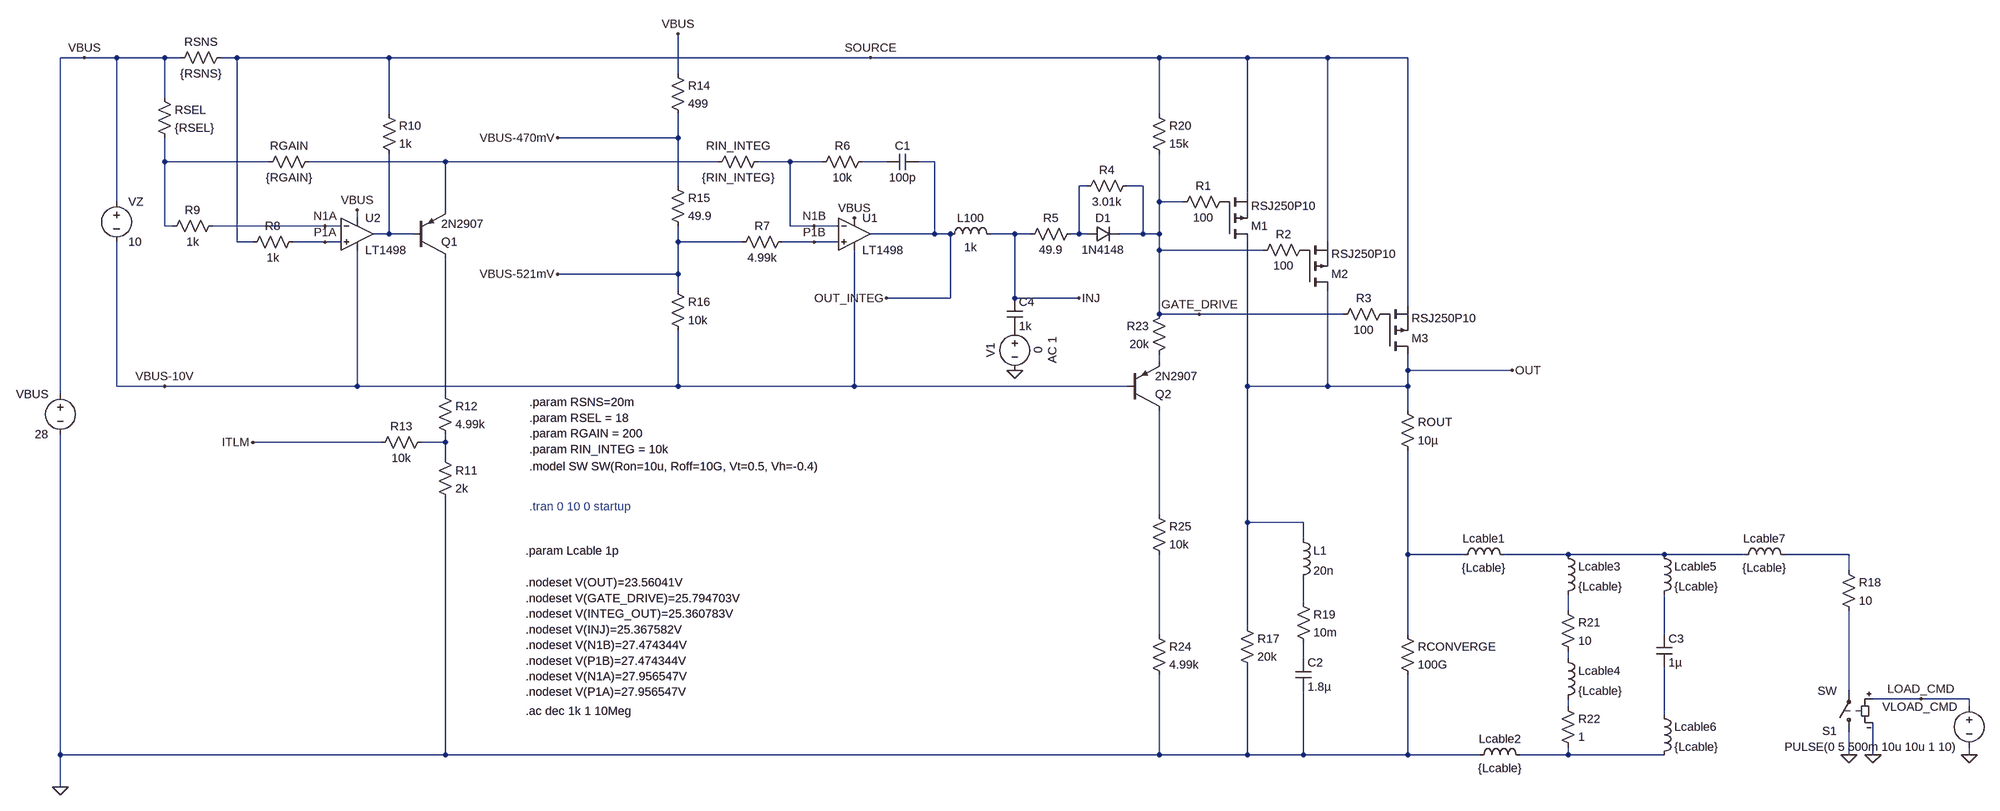
[diagram p0: schematic LM_RPC.asc]
LM_RPC.asc, the LTspice schematic file:
Version 4.1
SHEET 1 2276 1416
WIRE -1568 -208 -1616 -208
WIRE -1504 -208 -1568 -208
WIRE -1408 -208 -1504 -208
WIRE -1376 -208 -1408 -208
WIRE -1264 -208 -1296 -208
WIRE -960 -208 -1264 -208
WIRE 0 -208 -960 -208
WIRE 576 -208 0 -208
WIRE 752 -208 576 -208
WIRE 912 -208 752 -208
WIRE 1072 -208 912 -208
WIRE -384 -176 -384 -256
WIRE -1408 -128 -1408 -208
WIRE -960 -96 -960 -208
WIRE 576 -96 576 -208
WIRE -384 -48 -384 -96
WIRE -384 -48 -624 -48
WIRE -1408 0 -1408 -48
WIRE -1200 0 -1408 0
WIRE -848 0 -1120 0
WIRE -304 0 -848 0
WIRE -160 0 -224 0
WIRE -96 0 -160 0
WIRE 32 0 -16 0
WIRE 128 0 96 0
WIRE -384 48 -384 -48
WIRE 432 48 416 48
WIRE 544 48 512 48
WIRE 752 64 752 -208
WIRE -1504 80 -1504 -208
WIRE 576 80 576 -16
WIRE 624 80 576 80
WIRE -848 96 -848 0
WIRE -1024 112 -1024 96
WIRE -1408 128 -1408 0
WIRE -1392 128 -1408 128
WIRE -1088 128 -1312 128
WIRE -1056 128 -1088 128
WIRE -160 128 -160 0
WIRE -112 128 -160 128
WIRE -64 128 -112 128
WIRE -960 144 -960 -16
WIRE -960 144 -992 144
WIRE -912 144 -960 144
WIRE 128 144 128 0
WIRE 128 144 0 144
WIRE 160 144 128 144
WIRE 288 144 240 144
WIRE 320 144 288 144
WIRE 416 144 416 48
WIRE 416 144 400 144
WIRE 432 144 416 144
WIRE 544 144 544 48
WIRE 544 144 496 144
WIRE 576 144 576 80
WIRE 576 144 544 144
WIRE -1264 160 -1264 -208
WIRE -1232 160 -1264 160
WIRE -1088 160 -1152 160
WIRE -1056 160 -1088 160
WIRE -384 160 -384 128
WIRE -256 160 -384 160
WIRE -112 160 -176 160
WIRE -64 160 -112 160
WIRE 912 160 912 -208
WIRE 576 176 576 144
WIRE 784 176 576 176
WIRE -384 224 -384 160
WIRE -384 224 -624 224
WIRE -384 256 -384 224
WIRE 160 272 160 144
WIRE 160 272 32 272
WIRE 288 272 288 144
WIRE 416 272 288 272
WIRE 1072 288 1072 -208
WIRE 576 304 576 176
WIRE 656 304 576 304
WIRE 944 304 656 304
WIRE 576 400 576 384
WIRE 1072 416 1072 384
WIRE 1280 416 1072 416
WIRE -1504 448 -1504 160
WIRE -1408 448 -1504 448
WIRE -1024 448 -1024 176
WIRE -1024 448 -1408 448
WIRE -384 448 -384 336
WIRE -384 448 -1024 448
WIRE -32 448 -32 176
WIRE -32 448 -384 448
WIRE 512 448 -32 448
WIRE 752 448 752 160
WIRE 912 448 912 256
WIRE 912 448 752 448
WIRE 1072 448 1072 416
WIRE 1072 448 912 448
WIRE -1616 464 -1616 -208
WIRE -848 464 -848 192
WIRE 1072 496 1072 448
WIRE -976 560 -1232 560
WIRE -848 560 -848 544
WIRE -848 560 -896 560
WIRE -848 592 -848 560
WIRE 576 704 576 496
WIRE 752 720 752 448
WIRE 864 720 752 720
WIRE 864 752 864 720
WIRE 1072 784 1072 576
WIRE 1184 784 1072 784
WIRE 1392 784 1264 784
WIRE 1584 784 1392 784
WIRE 1744 784 1584 784
WIRE 1952 784 1824 784
WIRE 1952 816 1952 784
WIRE 864 880 864 832
WIRE 1392 896 1392 864
WIRE 752 928 752 720
WIRE 576 944 576 784
WIRE 1072 944 1072 784
WIRE 1584 944 1584 864
WIRE 864 992 864 960
WIRE 1392 992 1392 976
WIRE 1952 1056 1952 896
WIRE 2096 1072 2000 1072
WIRE 2192 1072 2096 1072
WIRE 1392 1088 1392 1072
WIRE 2192 1088 2192 1072
WIRE 1584 1104 1584 1008
WIRE -1616 1184 -1616 544
WIRE -848 1184 -848 672
WIRE -848 1184 -1616 1184
WIRE 576 1184 576 1024
WIRE 576 1184 -848 1184
WIRE 752 1184 752 1008
WIRE 752 1184 576 1184
WIRE 864 1184 864 1056
WIRE 864 1184 752 1184
WIRE 1072 1184 1072 1024
WIRE 1072 1184 864 1184
WIRE 1216 1184 1072 1184
WIRE 1392 1184 1392 1168
WIRE 1392 1184 1296 1184
WIRE 1584 1184 1392 1184
WIRE 1952 1184 1952 1136
WIRE 2000 1184 2000 1120
WIRE 2192 1184 2192 1168
WIRE -1616 1248 -1616 1184
FLAG 32 272 OUT_INTEG
FLAG 656 304 GATE_DRIVE
FLAG 416 272 INJ
FLAG -1568 -208 VBUS
FLAG -32 112 VBUS
FLAG -1024 96 VBUS
FLAG -1232 560 ITLM
FLAG -624 -48 VBUS-470mV
FLAG -624 224 VBUS-521mV
FLAG 1952 1184 0
FLAG 2192 1184 0
FLAG 2000 1184 0
FLAG 2096 1072 LOAD_CMD
FLAG -384 -256 VBUS
FLAG 1280 416 OUT
FLAG -1408 448 VBUS-10V
FLAG -1088 160 P1A
FLAG -1088 128 N1A
FLAG -112 160 P1B
FLAG -112 128 N1B
FLAG 0 -208 SOURCE
FLAG -1616 1248 0
FLAG 288 416 0
DATAFLAG 1184 416 ""
DATAFLAG 640 176 ""
DATAFLAG -768 -208 ""
DATAFLAG -768 -208 ""
DATAFLAG -1488 -208 ""
SYMBOL res 720 64 R90
WINDOW 0 0 56 VBottom 2
WINDOW 3 32 56 VTop 2
SYMATTR InstName R1
SYMATTR Value 100
SYMBOL res 880 160 R90
WINDOW 0 0 56 VBottom 2
WINDOW 3 32 56 VTop 2
SYMATTR InstName R2
SYMATTR Value 100
SYMBOL res 1040 288 R90
WINDOW 0 0 56 VBottom 2
WINDOW 3 32 56 VTop 2
SYMATTR InstName R3
SYMATTR Value 100
SYMBOL diode 432 160 R270
WINDOW 0 32 32 VTop 2
WINDOW 3 0 32 VBottom 2
SYMATTR InstName D1
SYMATTR Value 1N4148
SYMBOL res 528 32 R90
WINDOW 0 0 56 VBottom 2
WINDOW 3 32 56 VTop 2
SYMATTR InstName R4
SYMATTR Value 3.01k
SYMBOL res 416 128 R90
WINDOW 0 0 56 VBottom 2
WINDOW 3 32 56 VTop 2
SYMATTR InstName R5
SYMATTR Value 49.9
SYMBOL voltage 288 320 R0
WINDOW 0 -32 56 VBottom 2
WINDOW 3 32 56 VTop 2
WINDOW 123 60 56 VTop 2
WINDOW 39 0 0 Left 0
SYMATTR InstName V1
SYMATTR Value 0
SYMATTR Value2 AC 1
SYMBOL OpAmps\\LT1498 -32 80 R0
SYMATTR InstName U1
SYMBOL res -1392 -192 R270
WINDOW 0 32 56 VTop 2
WINDOW 3 0 56 VBottom 2
SYMATTR InstName RSNS
SYMATTR Value {RSNS}
SYMBOL voltage -1616 448 M0
SYMATTR InstName VBUS
SYMATTR Value 28
SYMBOL res -208 -16 R90
WINDOW 0 0 56 VBottom 2
WINDOW 3 32 56 VTop 2
SYMATTR InstName RIN_INTEG
SYMATTR Value {RIN_INTEG}
SYMBOL res 0 -16 R90
WINDOW 0 0 56 VBottom 2
WINDOW 3 32 56 VTop 2
SYMATTR InstName R6
SYMATTR Value 10k
SYMBOL cap 96 -16 R90
WINDOW 0 0 32 VBottom 2
WINDOW 3 32 32 VTop 2
SYMATTR InstName C1
SYMATTR Value 100p
SYMBOL voltage -1504 64 R0
WINDOW 123 0 0 Left 0
WINDOW 39 0 0 Left 0
SYMATTR InstName VZ
SYMATTR Value 10
SYMBOL res -160 144 R90
WINDOW 0 0 56 VBottom 2
WINDOW 3 32 56 VTop 2
SYMATTR InstName R7
SYMATTR Value 4.99k
SYMBOL res -1424 -144 R0
SYMATTR InstName RSEL
SYMATTR Value {RSEL}
SYMBOL res -1136 144 R90
WINDOW 0 0 56 VBottom 2
WINDOW 3 32 56 VTop 2
SYMATTR InstName R8
SYMATTR Value 1k
SYMBOL res -1296 112 R90
WINDOW 0 0 56 VBottom 2
WINDOW 3 32 56 VTop 2
SYMATTR InstName R9
SYMATTR Value 1k
SYMBOL OpAmps\\LT1498 -1024 80 R0
SYMATTR InstName U2
SYMBOL res -1104 -16 R90
WINDOW 0 0 56 VBottom 2
WINDOW 3 32 56 VTop 2
SYMATTR InstName RGAIN
SYMATTR Value {RGAIN}
SYMBOL pnp -912 192 M180
SYMATTR InstName Q1
SYMATTR Value 2N2907
SYMBOL res -976 -112 R0
SYMATTR InstName R10
SYMATTR Value 1k
SYMBOL res -864 576 R0
SYMATTR InstName R11
SYMATTR Value 2k
SYMBOL res -864 448 R0
SYMATTR InstName R12
SYMATTR Value 4.99k
SYMBOL res -880 544 R90
WINDOW 0 0 56 VBottom 2
WINDOW 3 32 56 VTop 2
SYMATTR InstName R13
SYMATTR Value 10k
SYMBOL res -400 -192 R0
SYMATTR InstName R14
SYMATTR Value 499
SYMBOL res -400 32 R0
SYMATTR InstName R15
SYMATTR Value 49.9
SYMBOL res -400 240 R0
SYMATTR InstName R16
SYMATTR Value 10k
SYMBOL res 736 912 R0
SYMATTR InstName R17
SYMATTR Value 20k
SYMBOL cap 848 992 R0
SYMATTR InstName C2
SYMATTR Value 1.8µ
SYMBOL sw 1952 1152 R180
SYMATTR InstName S1
SYMBOL voltage 2192 1072 M0
WINDOW 123 0 0 Left 0
WINDOW 39 0 0 Left 0
SYMATTR InstName VLOAD_CMD
SYMATTR Value PULSE(0 5 500m 10u 10u 1 10)
SYMBOL res 1056 480 R0
SYMATTR InstName ROUT
SYMATTR Value 10µ
SYMBOL res 560 -112 R0
SYMATTR InstName R20
SYMATTR Value 15k
SYMBOL pmos 704 160 M180
SYMATTR InstName M1
SYMATTR Value RSJ250P10
SYMBOL pmos 864 256 M180
SYMATTR InstName M2
SYMATTR Value RSJ250P10
SYMBOL pmos 1024 384 M180
SYMATTR InstName M3
SYMATTR Value RSJ250P10
SYMBOL res 1056 928 R0
SYMATTR InstName RCONVERGE
SYMATTR Value 100G
SYMBOL ind 1168 800 R270
WINDOW 0 32 56 VTop 2
WINDOW 3 5 56 VBottom 2
SYMATTR InstName Lcable1
SYMATTR Value {Lcable}
SYMBOL ind 1200 1200 R270
WINDOW 0 32 56 VTop 2
WINDOW 3 5 56 VBottom 2
SYMATTR InstName Lcable2
SYMATTR Value {Lcable}
SYMBOL ind 1376 768 R0
SYMATTR InstName Lcable3
SYMATTR Value {Lcable}
SYMBOL res 1376 880 R0
SYMATTR InstName R21
SYMATTR Value 10
SYMBOL ind 1376 976 R0
SYMATTR InstName Lcable4
SYMATTR Value {Lcable}
SYMBOL res 1376 1072 R0
SYMATTR InstName R22
SYMATTR Value 1
SYMBOL ind 1568 768 R0
SYMATTR InstName Lcable5
SYMATTR Value {Lcable}
SYMBOL ind 1568 1088 R0
SYMATTR InstName Lcable6
SYMATTR Value {Lcable}
SYMBOL cap 1568 944 R0
SYMATTR InstName C3
SYMATTR Value 1µ
SYMBOL ind 1728 800 R270
WINDOW 0 32 56 VTop 2
WINDOW 3 5 56 VBottom 2
SYMATTR InstName Lcable7
SYMATTR Value {Lcable}
SYMBOL res 1936 800 R0
SYMATTR InstName R18
SYMATTR Value 10
SYMBOL ind 848 736 R0
SYMATTR InstName L1
SYMATTR Value 20n
SYMBOL res 848 864 R0
SYMATTR InstName R19
SYMATTR Value 10m
SYMBOL pnp 512 496 M180
SYMATTR InstName Q2
SYMATTR Value 2N2907
SYMBOL res 592 288 M0
SYMATTR InstName R23
SYMATTR Value 20k
SYMBOL res 560 928 R0
SYMATTR InstName R24
SYMATTR Value 4.99k
SYMBOL res 560 688 R0
SYMATTR InstName R25
SYMATTR Value 10k
SYMBOL ind 144 160 R270
WINDOW 0 32 56 VTop 2
WINDOW 3 5 56 VBottom 2
SYMATTR InstName L100
SYMATTR Value 1k
SYMBOL cap 272 272 R0
SYMATTR InstName C4
SYMATTR Value 1k
TEXT -680 480 Left 2 !.param RSNS=20m\n.param RSEL = 18\n.param RGAIN = 200\n.param RIN_INTEG = 10k
TEXT -680 608 Left 2 !.model SW SW(Ron=10u, Roff=10G, Vt=0.5, Vh=-0.4)
TEXT -680 688 Left 2 ;.tran 0 10 0 startup
TEXT -688 776 Left 2 !.param Lcable 1p
TEXT -688 840 Left 2 !.nodeset V(OUT)=23.56041V\n.nodeset V(GATE_DRIVE)=25.794703V\n.nodeset V(INTEG_OUT)=25.360783V\n.nodeset V(INJ)=25.367582V\n.nodeset V(N1B)=27.474344V\n.nodeset V(P1B)=27.474344V\n.nodeset V(N1A)=27.956547V\n.nodeset V(P1A)=27.956547V
TEXT -688 1096 Left 2 !.ac dec 1k 1 10Meg

The netlist it stands for:
* LM_RPC.asc
R1 P001 GATE_DRIVE 100
R2 P002 GATE_DRIVE 100
R3 P003 GATE_DRIVE 100
D1 N004 GATE_DRIVE 1N4148
R4 GATE_DRIVE N004 3.01k
R5 N004 INJ 49.9
V1 P004 0 0 AC 1
X§U1 P1B N1B VBUS VBUS-10V OUT_INTEG LT1498  ; pins In+ In- V+ V- OUT
RSNS VBUS SOURCE {RSNS}
VBUS VBUS 0 28
RIN_INTEG N1B N002 {RIN_INTEG}
R6 N003 N1B 10k
C1 OUT_INTEG N003 100p
VZ VBUS VBUS-10V 10
R7 P1B VBUS-521mV 4.99k
RSEL VBUS N001 {RSEL}
R8 P1A SOURCE 1k
R9 N1A N001 1k
X§U2 P1A N1A VBUS VBUS-10V N005 LT1498  ; pins In+ In- V+ V- OUT
RGAIN N002 N001 {RGAIN}
Q1 N007 N005 N002 0 2N2907
R10 SOURCE N005 1k
R11 N008 0 2k
R12 N007 N008 4.99k
R13 N008 ITLM 10k
R14 VBUS VBUS-470mV 499
R15 VBUS-470mV VBUS-521mV 49.9
R16 VBUS-521mV VBUS-10V 10k
R17 OUT 0 20k
C2 N017 0 1.8µ
S1 0 N019 LOAD_CMD 0 SW
VLOAD_CMD LOAD_CMD 0 PULSE(0 5 500m 10u 10u 1 10)
ROUT OUT N010 10µ
R20 SOURCE GATE_DRIVE 15k
M1 OUT P001 SOURCE SOURCE RSJ250P10
M2 OUT P002 SOURCE SOURCE RSJ250P10
M3 OUT P003 SOURCE SOURCE RSJ250P10
RCONVERGE N010 0 100G
Lcable1 N010 N011 {Lcable}
Lcable2 0 N022 {Lcable}
Lcable3 N011 N014 {Lcable}
R21 N014 N018 10
Lcable4 N018 N020 {Lcable}
R22 N020 N022 1
Lcable5 N011 N016 {Lcable}
Lcable6 N021 N022 {Lcable}
C3 N016 N021 1µ
Lcable7 N011 N012 {Lcable}
R18 N012 N019 10
L1 OUT N013 20n
R19 N013 N017 10m
Q2 N009 VBUS-10V N006 0 2N2907
R23 GATE_DRIVE N006 20k
R24 N015 0 4.99k
R25 N009 N015 10k
L100 OUT_INTEG INJ 1k
C4 INJ P004 1k
.model D D
.lib standard.dio
.model NPN NPN
.model PNP PNP
.lib standard.bjt
.model NMOS NMOS
.model PMOS PMOS
.lib standard.mos
.param RSNS=20m
.param RSEL = 18
.param RGAIN = 200
.param RIN_INTEG = 10k
.model SW SW(Ron=10u, Roff=10G, Vt=0.5, Vh=-0.4)
* .tran 0 10 0 startup
.param Lcable 1p
.nodeset V(OUT)=23.56041V
.nodeset V(GATE_DRIVE)=25.794703V
.nodeset V(INTEG_OUT)=25.360783V
.nodeset V(INJ)=25.367582V
.nodeset V(N1B)=27.474344V
.nodeset V(P1B)=27.474344V
.nodeset V(N1A)=27.956547V
.nodeset V(P1A)=27.956547V
.ac dec 1k 1 10Meg
.lib LTC.lib
.backanno
.end